# EasyEDA Pro project ProPrj_Microros_esp32_2025-06-17.epro, board PCB_V3.0
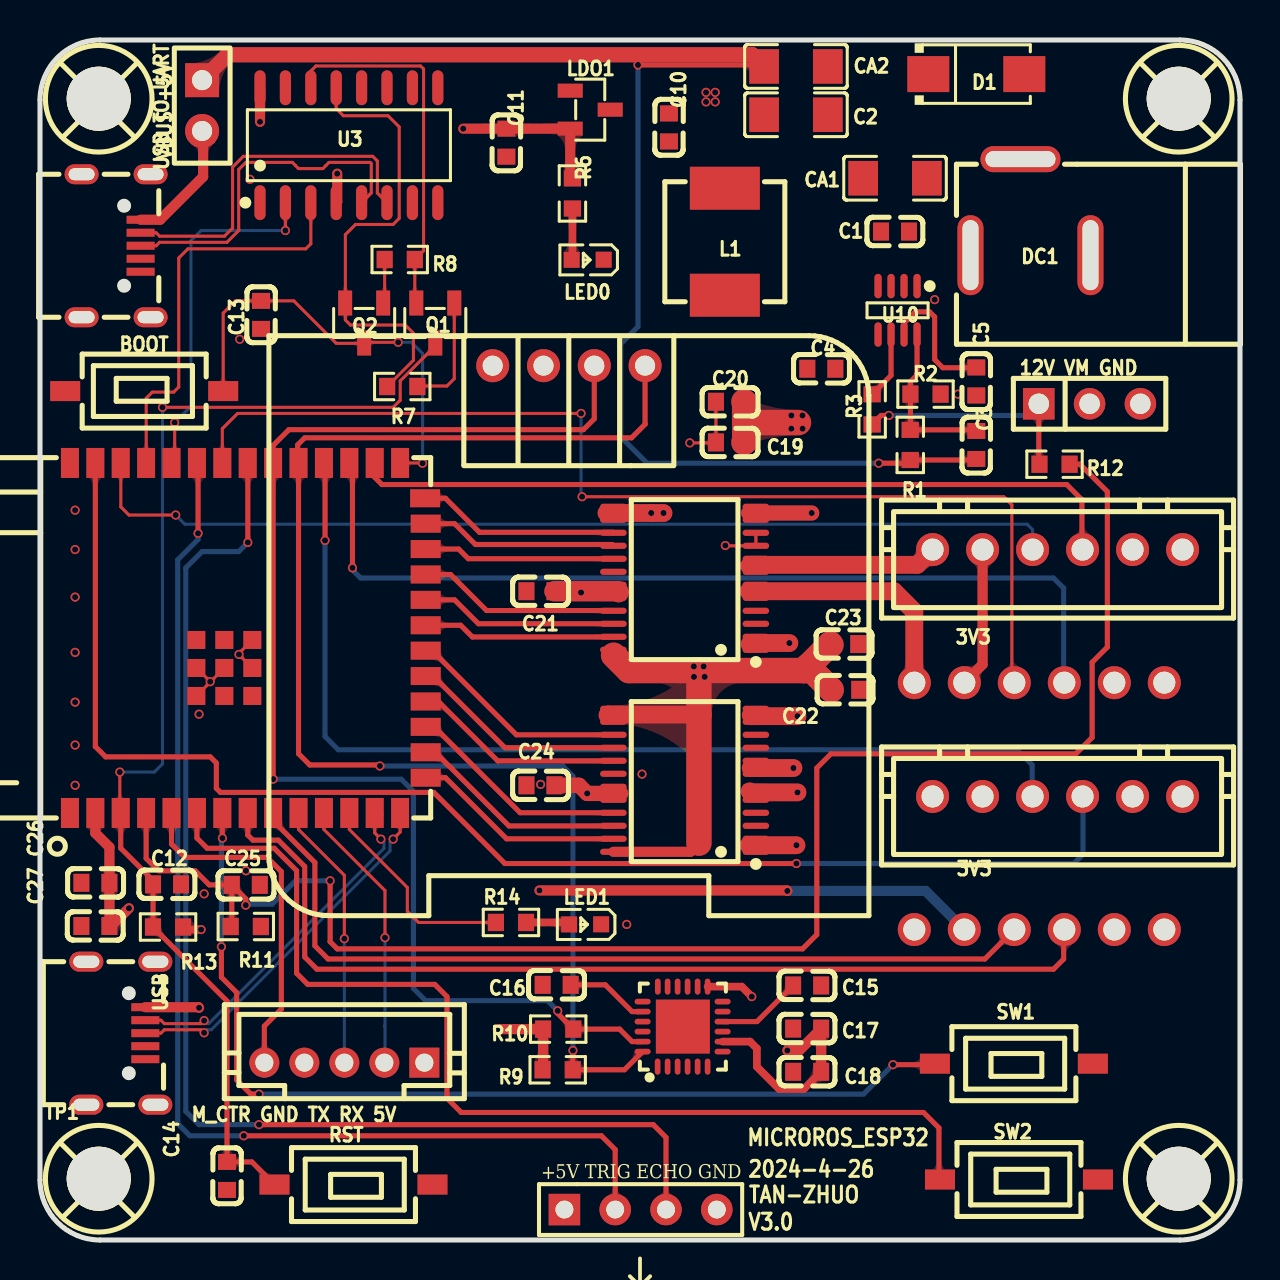
[diagram p4: board, top side]
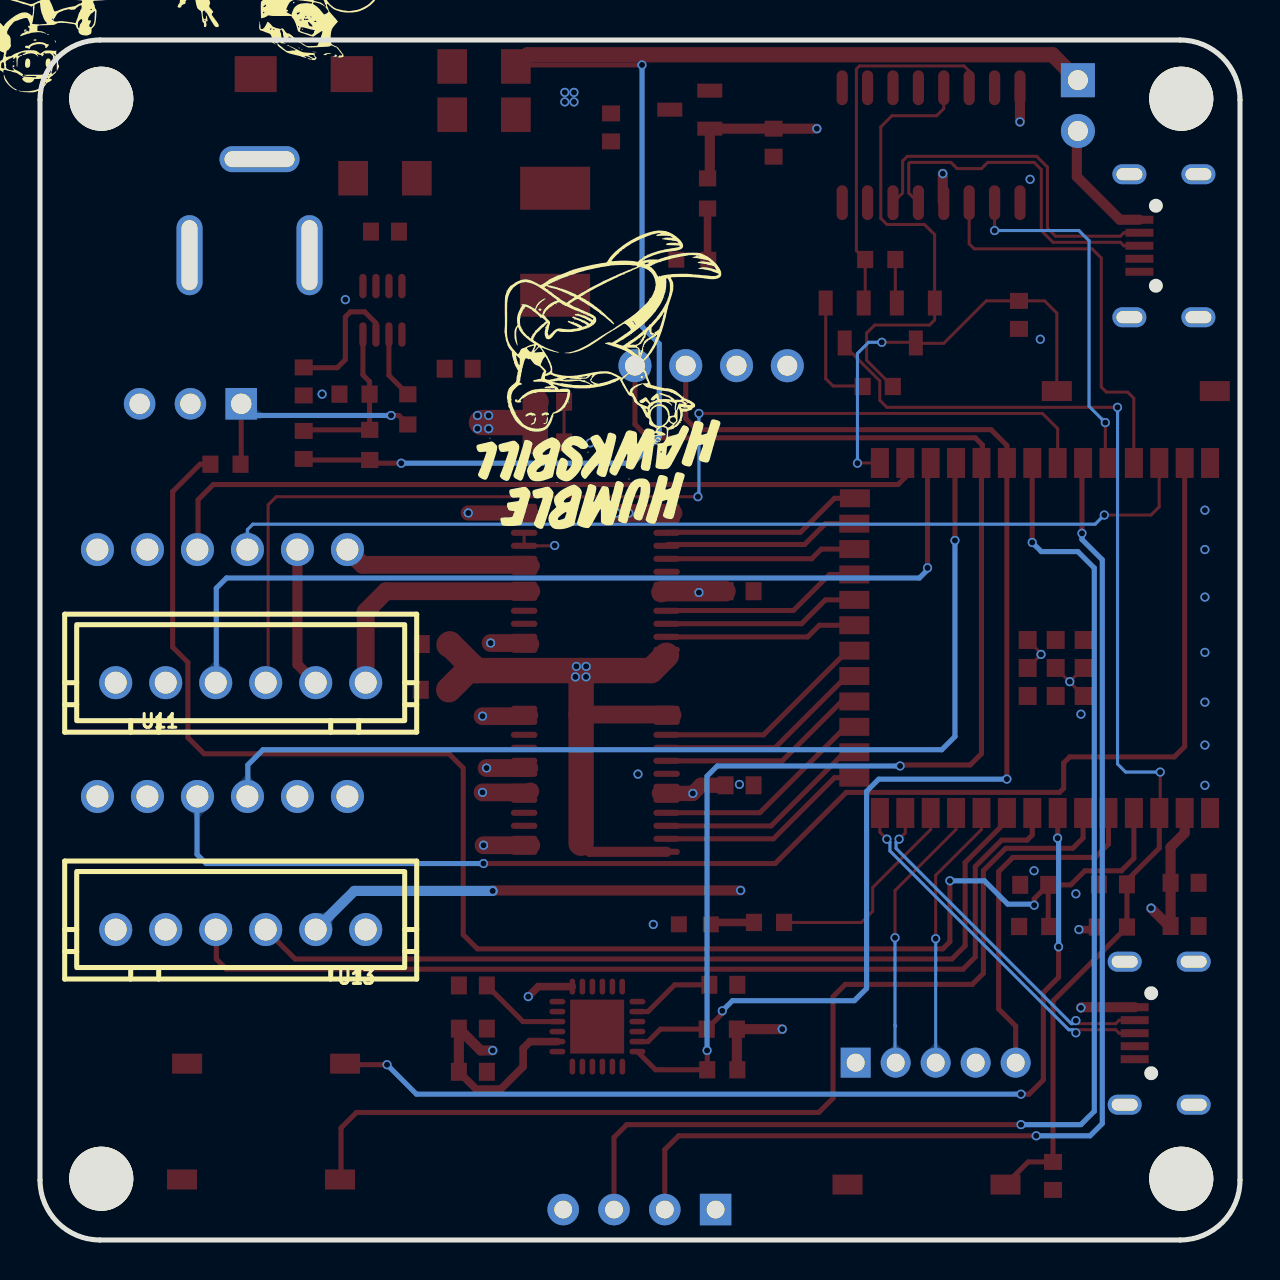
[diagram p5: board, bottom side, seen from below]

Outline 60 x 60 mm; copper layers: Top Layer, GND, POWER, Bottom Layer. Coordinates in mm from the lower left corner of the outline.
Outline path: 0,57 0,3 arc(0.88,0.88) 3,0 57,0 arc(59.12,0.88) 60,3 60,57 arc(59.12,59.12) 57,60 3,60 arc(0.88,59.12) 0,57
Stack: Top Layer 0.035mm 外层铜厚1oz / Dielectric1 0.2104mm 7628 RC49% 8.6mil / GND 0.0152mm 内层铜厚 / Dielectric2 1.065mm 1.1mm H/HOZ 含铜 / POWER 0.0152mm 内层铜厚 / Dielectric3 0.2104mm 7628 RC49% 8.6mil / Bottom Layer 0.035mm 外层铜厚1oz

## Design rules (mm)
net USB_DP: DP1
net USB_DN: DP1
net GPIO_19: DP2
net GPIO_20: DP2
template: 自定义配置
spacing copperThickness1oz (default): track to track 0.102, other pairs 0 to 0.3
spacing copperThickness2oz: track to track 0.203, other pairs 0.152 to 0.3
track width copperThickness1oz (default): min 0.127, default 0.178, max 2.54
track width copperThickness2oz: min 0.203, default 0.254, max 2.54
differential pair differentialPair (default): width min 0.152, default 0.152, max 0.152; gap min 0.152, default 0.152
via viaSize (default): diameter min 0.254, default 0.457, max 10; hole min 0.3, default 0.305, max 6.299

## Placement (name value [footprint] x y rotation side)
3V3  -  [CONN-TH_XH2.54-6P]  50.88 34.52 0 top
3V3#2  -  [CONN-TH_XH2.54-6P]  50.88 22.18 0 top
12V VM GND  -  [HDR-TH_3P-P2.54-V-F]  52.48 41.81 0 top
+5V TRIG ECHO GND  -  [HC-SR04]  30 1.49 0 top
BOOT  -  [Key_SMD_3.6x6.1x2.5]  5.21 42.45 0 top
C1  0.1uf  [C0603]  42.75 50.42 0 top
C2  22uf  [C1206]  37.8 56.26 180 top
C3  33PF  [C0603]  46.81 39.75 90 top
C4  0.1uf  [C0603]  39.07 43.56 180 top
C5  0.1uf  [C0603]  46.81 42.93 90 top
C10  1uf  [C0603]  31.45 55.63 270 top
C11  1uf  [C0603]  23.32 54.87 90 top
C12  1uf  [C0603]  6.35 17.78 0 top
C13  0.1uf  [C0603]  11.05 46.26 270 top
C14  0.1uf  [C0603]  9.35 3.2 270 top
C15  0.1uf  [C0603]  38.36 12.73 0 top
C16  2.2uf  [C0603]  25.83 12.76 0 top
C17  10nf  [C0603]  38.36 10.57 0 top
C18  0.1uf  [C0603]  38.36 8.41 0 top
C19  10uf  [C0603]  34.5 39.88 180 top
C20  0.1uf  [C0603]  34.5 41.91 180 top
C21  0.1uf  [C0603]  25.02 32.44 180 top
C22  10uf  [C0603]  40.26 27.51 0 top
C23  0.1uf  [C0603]  40.21 29.8 0 top
C24  0.1uf  [C0603]  25.02 22.74 180 top
C25  0.1uf  [C0603]  10.29 17.76 180 top
C26  22uF  [C0603]  2.77 17.86 180 top
C27  100nF  [C0603]  2.77 15.7 0 top
CA1  22uf  [C1206]  42.75 53.09 0 top
CA2  22uf  [C1206]  37.8 58.68 0 top
D1  SMAJ12A  [SMA_L4.3-W2.8-LS5.1-RD]  46.81 58.3 0 top
DC1  -  [DC-2.0]  49.65 48.97 0 top
L1  4.7uH  [IND-SMD_L6.5-W6.0_GPSR0630]  34.24 49.91 90 top
LDO1  SC662K-3.3V  [SOT-23-3_L2.9-W1.3-P1.90-LS2.4-BR]  27.51 56.52 180 top
LED0  -  [LED_0603]  27.33 49 180 top
LED1  -  [LED_0603]  27.21 15.78 180 top
M_CTR GND TX RX 5V  BX-PH2.0-5PZZ  [CONN-TH_5P-P2.00_BX-PH2.0-5PZZ]  15.22 8.87 180 top
OLED1  0.96OLED_4P_MODULE_JX  [0.96OLED_4P]  26.44 43.72 0 top
Q1  L8050QLT1G  [SOT-23-3_L2.9-W1.3-P1.90-LS2.4-BR]  19.76 45.85 90 top
Q2  L8050QLT1G  [SOT-23-3_L2.9-W1.3-P1.90-LS2.4-BR]  16.21 45.85 90 top
R1  -  [R0603]  43.51 39.75 90 top
R2  -  [R0603]  44.28 42.29 0 top
R3  -  [R0603]  41.61 41.53 90 top
R6  -  [R0603]  26.62 52.33 270 top
R7  -  [R0603]  18.11 42.67 0 top
R8  -  [R0603]  17.99 49.02 180 top
R9  -  [R0603]  25.88 8.51 180 top
R10  -  [R0603]  25.91 10.54 180 top
R11  -  [R0603]  10.29 15.67 180 top
R12  -  [R0603]  50.73 38.79 180 top
R13  10kΩ  [R0603]  6.4 15.65 0 top
R14  -  [R0603]  23.55 15.88 0 top
RST  -  [Key_SMD_3.6x6.1x2.5]  15.67 2.77 180 top
SW1  -  [Key_SMD_3.6x6.1x2.5]  48.69 8.82 180 top
SW2  -  [Key_SMD_3.6x6.1x2.5]  48.95 3.03 180 top
TP1  -  [M3螺丝]  3 3 0 top
TP2  -  [M3螺丝]  57 3 0 top
TP3  -  [M3螺丝]  57 57 0 top
TP4  -  [M3螺丝]  3 57 0 top
U1  ESP32-S3-WROOM-1-N16R2  [WIRELM-SMD_ESP32-S3-WROOM-1]  10.39 30.1 90 top
U3  CH340C  [SOP-16_L10.0-W3.9-P1.27-LS6.0-BL]  15.45 54.74 0 top
U6  MPU-6050  [QFN-24_L4.0-W4.0-P0.50-BL-EP2.7]  32.13 10.67 0 top
U7  TB6612FNG,C,8,EL  [SSOP-24_L8.3-W5.6-P0.65-LS7.6-BL]  32.23 33.08 90 top
U8  TB6612FNG,C,8,EL  [SSOP-24_L8.3-W5.6-P0.65-LS7.6-BL]  32.23 22.98 90 top
U10  MP2225GJ-Z  [TSOT-23-8_L2.9-W1.6-P0.65-LS2.8-BR]  42.88 46.48 90 top
U11  6PIN-2.54MM  [CONN-TH_XH2.54-6P]  49.96 27.87 0 bottom
U13  6PIN-2.54MM  [CONN-TH_XH2.54-6P]  49.96 15.52 0 bottom
USB  -  [USB_Micro]  4.04 10.34 270 top
USB TO UART  -  [USB_Micro]  3.81 49.71 270 top
VBUS +5V  -  [HDR-TH_2P-P2.54-V-F]  8.1 56.72 270 top

## Footprints (pads in the part's own frame, mm; a bottom-side part is the same pattern mirrored in y, then rotated)
0.96OLED_4P
  round 1.65 hole 1: 1(-3.81,-0.002) 2(-1.27,0.002) 3(1.27,0.002) 4(3.81,0.002)
C0603
  rect 0.8x0.9 smd: 1(-0.7,0) 2(0.7,0)
C1206
  rect 1.485x1.728 smd: 1(-1.593,0) 2(1.593,0)
CONN-TH_5P-P2.00_BX-PH2.0-5PZZ
  rect 1.5x1.5 hole 0.9: 1(-4,0)
  round 1.5 hole 0.9: 2(-2,0) 3(0,0) 4(2,0) 5(4,0)
CONN-TH_XH2.54-6P
  round 1.65 hole 1.1: 1(-6.25,0) 2(-3.75,0) 3(-1.25,0) 4(1.25,0) 5(3.75,0) 6(6.25,0)
DC-2.0
  oval 4x1.3 hole 3.5x0.8: 2(-0.627,5.067)
  oval 1.3x4 hole 0.8x3.5: 3(2.873,0.267) 4(-3.127,0.267)
HC-SR04
  rect 1.575x1.575 hole 0.889: 1(-3.78,0.03)
  round 1.575 hole 0.889: 2(-1.24,0.03) 3(1.3,0.03) 4(3.84,0.03)
HDR-TH_2P-P2.54-V-F
  rect 1.7x1.7 hole 1: 1(-1.27,0)
  round 1.7 hole 1: 2(1.27,0)
HDR-TH_3P-P2.54-V-F
  rect 1.575x1.575 hole 1.02: 1(-2.54,0)
  round 1.575 hole 1.02: 2(0,0) 3(2.54,0)
IND-SMD_L6.5-W6.0_GPSR0630
  rect 2.15x3.5 smd: 1(-2.675,0) 2(2.675,0)
Key_SMD_3.6x6.1x2.5
  rect 1.501x1.001 smd: 1(-3.95,0) 2(3.95,0)
LED_0603
  rect 0.8x0.8 smd: 1(-0.851,-0.01) 2(0.75,-0.005)
M3螺丝
  round 3.2 hole 3.2: 1(-0.064,0.064)
QFN-24_L4.0-W4.0-P0.50-BL-EP2.7
  oval 0.28x0.8 smd: 1(-1.25,-2) 2(-0.75,-2) 3(-0.25,-2) 4(0.25,-2) 5(0.75,-2) 6(1.25,-2) 13(1.25,2) 14(0.75,2) 15(0.25,2) 16(-0.25,2) 17(-0.75,2) 18(-1.242,2)
  oval 0.8x0.28 smd: 7(2,-1.25) 8(2,-0.75) 9(2,-0.25) 10(2,0.25) 11(2,0.75) 12(2,1.25) 19(-2,1.25) 20(-2,0.75) 21(-2,0.25) 22(-2,-0.25) 23(-2,-0.75) 24(-2,-1.25)
  rect 2.7x2.7 smd: 25(0.013,0)
R0603
  rect 0.806x0.864 smd: 1(-0.753,0) 2(0.753,0)
SMA_L4.3-W2.8-LS5.1-RD
  rect 2.1x1.8 smd: 1(-2.4,0) 2(2.4,0)
SOP-16_L10.0-W3.9-P1.27-LS6.0-BL
  oval 0.56x1.745 smd: 1(-4.445,-2.873) 2(-3.175,-2.873) 3(-1.905,-2.873) 4(-0.635,-2.873) 5(0.635,-2.873) 6(1.905,-2.873) 7(3.175,-2.873) 8(4.445,-2.873) 9(4.445,2.873) 10(3.175,2.873) 11(1.905,2.873) 12(0.635,2.873) 13(-0.635,2.873) 14(-1.905,2.873) 15(-3.175,2.873) 16(-4.445,2.873)
SOT-23-3_L2.9-W1.3-P1.90-LS2.4-BR
  rect 1.25x0.7 smd: 1(1,-0.95) 2(1,0.95) 3(-1,0)
SSOP-24_L8.3-W5.6-P0.65-LS7.6-BL
  oval 0.308x1.324 smd: 1(-3.575,-3.562) 2(-2.925,-3.562) 3(-2.275,-3.562) 4(-1.625,-3.562) 5(-0.975,-3.562) 6(-0.325,-3.562) 7(0.325,-3.562) 8(0.975,-3.562) 9(1.625,-3.562) 10(2.275,-3.562) 11(2.925,-3.562) 12(3.575,-3.562) 13(3.575,3.562) 14(2.925,3.562) 15(2.275,3.562) 16(1.625,3.562) 17(0.975,3.562) 18(0.325,3.562) 19(-0.325,3.562) 20(-0.975,3.562) 21(-1.625,3.562) 22(-2.275,3.562) 23(-2.925,3.562) 24(-3.575,3.562)
TSOT-23-8_L2.9-W1.6-P0.65-LS2.8-BR
  oval 1.222x0.364 smd: 1(1.211,-0.975) 2(1.211,-0.325) 3(1.211,0.325) 4(1.211,0.975) 5(-1.211,0.975) 6(-1.211,0.325) 7(-1.211,-0.325) 8(-1.211,-0.975)
USB_Micro
  rect 0.4x1.4 smd: 1(-1.3,1.225) 2(-0.65,1.225) 3(0,1.225) 4(0.65,1.225) 5(1.3,1.225)
  oval 1x1.7 hole 0.6x1.3: 6(-3.575,1.725) 6(-3.575,-1.725) 6(3.575,1.725) 6(3.575,-1.725)
WIRELM-SMD_ESP32-S3-WROOM-1
  rect 1.5x0.9 smd: 1(-8.75,8.895) 2(-8.75,7.625) 3(-8.75,6.355) 4(-8.75,5.085) 5(-8.75,3.815) 6(-8.75,2.545) 7(-8.75,1.275) 8(-8.75,0.005) 9(-8.75,-1.265) 10(-8.75,-2.535) 11(-8.75,-3.805) 12(-8.75,-5.075) 13(-8.75,-6.345) 14(-8.75,-7.615) 27(8.75,-7.615) 28(8.75,-6.345) 29(8.75,-5.075) 30(8.75,-3.805) 31(8.75,-2.535) 32(8.75,-1.265) 33(8.75,0.005) 34(8.75,1.275) 35(8.75,2.545) 36(8.75,3.815) 37(8.75,5.085) 38(8.75,6.355) 39(8.75,7.625) 40(8.75,8.895)
  rect 0.9x1.5 smd: 15(-6.985,-8.895) 16(-5.715,-8.895) 17(-4.445,-8.895) 18(-3.175,-8.895) 19(-1.905,-8.895) 20(-0.635,-8.895) 21(0.635,-8.895) 22(1.905,-8.895) 23(3.175,-8.895) 24(4.445,-8.895) 25(5.715,-8.895) 26(6.985,-8.865)
  rect 0.9x0.9 smd: 41(-2.9,2.575) 41(-2.9,1.175) 41(-2.9,-0.225) 41(-1.5,2.575) 41(-1.5,1.175) 41(-1.5,-0.225) 41(-0.1,2.575) 41(-0.1,1.175) 41(-0.1,-0.225)

## Nets
+5V: +5V TRIG ECHO GND.1 C2.2 C3.1 C10.1 C21.1 C24.1 CA2.1 L1.2 LDO1.3 M_CTR GND TX RX 5V.1 OLED1.2 R1.1 U7.19 U7.20 U8.19 U8.20 USB.1 VBUS +5V.1
+12V: 12V VM GND.1 C1.2 CA1.2 D1.1 DC1.4 R3.1 R12.2 U10.2
GND: 3V3.5 3V3#2.5 12V VM GND.3 +5V TRIG ECHO GND.4 BOOT.1 C1.1 C2.1 C5.1 C10.2 C11.1 C12.2 C13.2 C14.2 C15.2 C16.1 C17.1 C18.1 C19.2 C20.2 C21.2 C22.2 C23.2 C24.2 C25.1 C26.2 C27.1 CA1.1 CA2.2 D1.2 DC1.2 DC1.3 LDO1.1 LED0.1 LED1.1 M_CTR GND TX RX 5V.4 OLED1.1 R2.2 R11.1 RST.1 SW1.1 SW2.1 U1.1 U1.40 U1.41 U3.1 U6.1 U6.9 U6.11 U6.18 U6.25 U7.3 U7.4 U7.9 U7.10 U7.18 U8.3 U8.4 U8.9 U8.10 U8.18 U10.1 U10.4 U11.5 U13.5 USB.5 USB.6 USB TO UART.5 USB TO UART.6
VBUS1: USB TO UART.1 VBUS +5V.2
VCC_3V3: 3V3.2 3V3#2.2 C11.2 C17.2 C18.2 C26.1 C27.2 LDO1.2 R6.1 R9.2 R10.2 R13.2 U1.2 U3.4 U3.16 U6.8 U6.13 U11.2 U13.2
ADC: C25.2 R11.2 R12.1 U1.4
DTR: Q2.2 R7.1 U3.13
ECHO: +5V TRIG ECHO GND.3 U1.33
ENCODE1_A: U1.29 U11.4
ENCODE1_B: U1.34 U11.3
ENCODE2_A: 3V3.4 U1.28
ENCODE2_B: 3V3.3 U1.38
ENCODE3_A: U1.8 U13.4
ENCODE3_B: U1.9 U13.3
ENCODE4_A: 3V3#2.4 U1.39
ENCODE4_B: 3V3#2.3 U1.30
ESP_RST: C12.1 C14.1 Q1.3 R13.1 RST.2 U1.3
ESP_RX: U1.36 U3.2
ESP_TX: U1.37 U3.3
GPIO_0: BOOT.2 C13.1 Q2.3 U1.27
GPIO_3: U1.15 U8.23
GPIO_5: M_CTR GND TX RX 5V.5 U1.5
GPIO_6: SW2.2 U1.6
GPIO_7: SW1.2 U1.7
GPIO_8: R14.1 U1.12
GPIO_9: U1.17 U8.21
GPIO_10: U1.18 U8.17
GPIO_11: U1.19 U8.16
GPIO_12: U1.20 U8.15
GPIO_13: U1.21 U7.23
GPIO_14: U1.22 U7.22
GPIO_19: U1.13 USB.2
GPIO_20: U1.14 USB.3
GPIO_21: U1.23 U7.21
GPIO_38: OLED1.4 R9.1 U1.31 U6.24
GPIO_39: OLED1.3 R10.1 U1.32 U6.23
GPIO_42: +5V TRIG ECHO GND.2 U1.35
GPIO_45: U1.26 U7.15
GPIO_46: U1.16 U8.22
GPIO_47: U1.24 U7.17
GPIO_48: U1.25 U7.16
M1_AO1: U7.1 U7.2 U11.6
M1_AO2: U7.5 U7.6 U11.1
M1_BO1: 3V3.6 U7.11 U7.12
M1_BO2: 3V3.1 U7.7 U7.8
M2_AO1: U8.1 U8.2 U13.6
M2_AO2: U8.5 U8.6 U13.1
M2_BO1: 3V3#2.6 U8.11 U8.12
M2_BO2: 3V3#2.1 U8.7 U8.8
RTS: Q1.2 R8.1 U3.14
U1_RX: M_CTR GND TX RX 5V.2 U1.11
U1_TX: M_CTR GND TX RX 5V.3 U1.10
USB_DN: U3.6 USB TO UART.2
USB_DP: U3.5 USB TO UART.3
VMOTOR: 12V VM GND.2 C19.1 C20.1 C22.1 C23.1 U7.13 U7.14 U7.24 U8.13 U8.14 U8.24
$1N8417: LED0.2 R6.2
$1N8423: Q1.1 R7.2
$1N8428: Q2.1 R8.2
$1N8498: C15.1 U6.10
$1N8500: C16.2 U6.20
$1N8840: C5.2 U10.7
$1N8848: R3.2 U10.6
$1N8850: C4.2 L1.1 U10.3
$1N8851: C4.1 U10.5
$1N8854: C3.2 R1.2 R2.1 U10.8
$1N21655: LED1.2 R14.2

Pads without a net: TP1 1; TP2 1; TP3 1; TP4 1; U3 7 8 9 10 11 12 15; U6 2 3 4 5 6 7 12 14 15 16 17 19 21 22; USB 4; USB TO UART 4

## Via types
v1: diameter 0.457, hole 0.305, Top Layer to Bottom Layer, 89 vias

## Routing (per net, layer and track width the routed paths; a pad name or vN(x,y) marks a point on that pad's centre or on a via; arc(x,y) is an arc through that point)
+5V: length 169.6
  Top Layer w0.254: C3.1 46.76,39 R1.1 43.35,38.84 v1(41.94,38.84) ; 36.13,58.75 v1(29.9,58.75)
  Top Layer w0.508: USB.1 7.92,11.64 v1(7.95,11.61)
  Top Layer w0.762: 25.79,22.74 26.95,22.74 v1(27.36,22.33) 28.88,22.33 28.93,22.38 28.98,22.38 29.03,22.33 ; 36.21,58.68 36.13,58.75 35.62,59.26 9.38,59.26 VBUS +5V.1
  Top Layer w1.016: C21.1 28.88,32.44 28.93,32.39
  POWER w0.508: v1(7.95,11.61) 8.21,11.86 17.81,11.86 18.98,10.7 19.22,10.7 25.43,4.48 28.41,4.48
  POWER w1.016: +5V TRIG ECHO GND.1 26.22,2.29 28.41,4.48 28.41,9.46 27.09,10.78 27.36,11.05 v1(27.36,22.33) 27.05,22.63 v1(27.05,32.37) 27.05,33 26.09,33.96 26.09,43.77 26.04,43.82 26.04,54.99 27.95,56.91 v1(33.76,56.91)
  Bottom Layer w0.254: v1(41.94,38.84) 30.36,38.84 29.03,40.16 29.03,44.8 29.9,45.67 v1(29.9,58.75)
  vias: v1(33.3,57.38) v1(33.3,56.9) v1(33.76,57.38)
+12V: length 11.8
  Top Layer w0.254: 12V VM GND.1 49.94,38.82 R12.2 ; v1(42.45,41.23) 42.06,41.23 R3.1
  Bottom Layer w0.254: v1(42.45,41.23) 49.35,41.23 12V VM GND.1
GND: length 16.3
  Top Layer w0.152: v1(34.27,34.72) 34.28,34.71 U7.9 U7.10 ; U1.41 8.53,27.92 v1(8.51,27.92) ; v1(32.49,39.86) 33.77,39.86 C19.2 C20.2 ; U1.41 7.83,28.6 v1(8.51,27.92) ; v1(8.51,27.92) 8.51,27.9 U1.41 ; U1.41 10.09,29.13 10.09,29.14 v1(9.95,29.28) 9.95,29.33 U1.41
  GND w0.152: v1(34.27,34.72) 34.27,37.62 32.49,39.4 v1(32.49,39.86)
  vias: v1(1.75,36.49) v1(1.75,34.52) v1(1.75,32.15) v1(1.75,29.38) v1(1.75,26.89) v1(1.75,24.75) v1(1.75,22.74) v1(7.95,26.29) v1(8.21,17.31) v1(9.99,45.04) v1(10.3,18.46) v1(10.5,53.03) v1(25.03,22.78) v1(29.34,15.78) v1(30.1,23.29) v1(44.73,47.02) v1(45.9,42.29)
VBUS1: length 6.3
  Top Layer w0.508: VBUS +5V.2 8.16,55.4 8.16,53.17 6,51.01 USB TO UART.1
VCC_3V3: length 172
  Top Layer w0.381: U6.8 35.5,9.92 35.84,9.58 35.84,8.66 36.96,7.55 38.19,7.55 C18.2 ; v1(35.59,12.17) 35.09,12.67 U6.13 ; R13.2 7.28,15.52 v1(8.05,15.52)
  Top Layer w0.508: v1(4.45,16.59) 3.56,15.7 C27.2 C26.1 3.47,19.64 2.77,20.35 U1.2 ; U3.4 14.86,51.92 v1(14.86,53.32) ; v1(37.37,9.48) 37.96,9.48 C17.2 C18.2 ; LDO1.2 26.51,53.19 R6.1 ; 26.51,55.57 C11.2 v1(21.16,55.57) ; R9.2 25.16,8.54 R10.2 v1(22.89,10.54) ; v1(37.37,17.45) 37.34,17.48 v1(24.97,17.48) ; U11.2 47.13,28.78 3V3.2 ; v1(11,55.91) 11,57.51
  GND w0.508: 3V3#2.2 47.13,26.95 U11.2
  POWER w0.381: v1(37.37,9.48) 36.76,9.48 36.35,9.88 36.35,11.41 v1(35.59,12.17) ; 8.54,16.26 8.05,15.77 v1(8.05,15.52)
  POWER w0.508: v1(37.37,17.45) v1(37.37,9.48) ; 14.86,55.55 v1(14.86,53.32) ; 14.86,55.55 11.36,55.55 v1(11,55.91) ; 14.86,55.55 14.88,55.57 v1(21.16,55.57) 21.16,17.48 ; 21.16,17.48 21.16,15.81 ; 21.16,17.48 v1(24.97,17.48) ; 21.16,15.81 8.99,15.81 8.54,16.26 8.21,16.59 v1(4.45,16.59) ; 21.16,15.81 21.16,10.65 21.26,10.54 v1(22.89,10.54) ; U13.2 47.13,16.44 3V3#2.2
  Bottom Layer w0.508: v1(37.37,17.45) 44.28,17.45 U13.2
ADC: length 80.9
  Top Layer w0.254: U1.4 5.31,19.08 5.93,18.46 7.76,18.46 8.46,17.76 C25.2 ; R11.2 9.59,15.73 C25.2 ; v1(10.29,16.74) 10.29,17.06 C25.2 ; v1(14.51,17.96) 14.51,14.91 14.86,14.56 38.13,14.56 38.84,15.27 38.84,23.6 39.55,24.31 51.79,24.31 52.61,25.12 52.61,28.88 53.37,29.64 53.37,37.42 52,38.79 R12.1
  Bottom Layer w0.254: v1(14.51,17.96) 12.78,17.96 11.61,16.79 10.34,16.79 v1(10.29,16.74)
DTR: length 23.3
  Top Layer w0.152: R7.1 18.67,43.99 18.67,45.34 18.26,45.75 15.52,45.75 15.27,46 15.27,46.84 Q2.2 15.27,46.86 15.27,50.27 15.78,50.78 17.66,50.78 17.96,51.08 17.96,55.65 17.4,56.21 15.17,56.21 14.81,56.57 U3.13
ECHO: length 62.9
  Top Layer w0.254: v1(10.39,34.88) 10.39,38.85 U1.33 ; +5V TRIG ECHO GND.3 31.3,5.13 30.66,5.77 v1(10.95,5.77)
  Bottom Layer w0.254: v1(10.95,5.77) 7.95,5.77 7.29,6.43 7.29,33.6 8.1,34.42 9.93,34.42 v1(10.39,34.88)
ENCODE1_A: length 46.1
  Top Layer w0.254: U1.29 15.62,38.69 v1(15.62,33.61)
  Bottom Layer w0.254: v1(15.62,33.61) 15.62,33.5 16.03,33.1 50.68,33.1 51.18,32.59 51.18,27.9 U11.4
ENCODE1_B: length 54.8
  Top Layer w0.152: v1(27.1,37.16) 48.19,37.16 48.59,36.76 48.59,27.99 U11.3 ; U1.34 9.12,40.57 9.88,41.33 v1(27.05,41.33)
  Bottom Layer w0.152: v1(27.05,41.33) 27.05,37.21 v1(27.1,37.16)
ENCODE2_A: length 39
  Top Layer w0.254: 3V3.4 52.1,34.55 52.1,37.01 51.34,37.77 17.1,37.77 16.74,38.13 U1.28
ENCODE2_B: length 49.3
  Top Layer w0.152: U1.38 4.04,38.85 4.04,36.66 4.45,36.25 v1(6.78,36.25)
  Bottom Layer w0.152: v1(6.78,36.25) 7.24,35.79 49.35,35.79 49.63,35.52 3V3.3
ENCODE3_A: length 49
  Top Layer w0.254: U1.8 10.39,20.25 10.65,19.99 11.91,19.99 13.24,18.67 13.24,14.15 13.85,13.54 50.68,13.54 51.18,14.05 51.18,15.49 U13.4
ENCODE3_B: length 43.4
  Top Layer w0.254: U1.9 11.66,20.96 13.74,18.88 13.74,14.71 14.4,14.05 47.24,14.05 U13.3
ENCODE4_A: length 69.8
  Top Layer w0.254: v1(37.82,18.82) 23.24,18.82 19.69,22.38 9.02,22.38 8.82,22.58 8.82,23.85 8.51,24.16 3.28,24.16 2.77,24.67 U1.39
  Bottom Layer w0.254: v1(37.82,18.82) 51.69,18.82 52.15,19.28 52.15,22.16 3V3#2.4
ENCODE4_B: length 51.2
  Top Layer w0.254: v1(14.25,34.98) 14.25,38.8 U1.30
  Bottom Layer w0.254: v1(14.25,34.98) 14.25,25.17 14.91,24.51 48.85,24.51 49.61,23.75 49.61,22.2 3V3#2.3
ESP_RST: length 60.3
  Top Layer w0.152: v1(6.12,41.63) 17.66,41.63 18.01,41.99 18.01,42.95 19.76,44.71 Q1.3 ; v1(3.99,23.4) 3.99,21.4 U1.3
  Top Layer w0.254: RST.2 10.59,3.9 C14.1 9.35,11.95 R13.1 5.65,15.65 C12.1 5.65,17.97 4.04,19.59 U1.3
  Bottom Layer w0.152: v1(6.12,41.63) 6.12,23.8 5.72,23.4 v1(3.99,23.4)
ESP_RX: length 17.8
  Top Layer w0.152: U1.36 6.73,39.01 v1(6.73,40.87) ; v1(12.27,50.47) U3.2
  Bottom Layer w0.152: v1(12.27,50.47) 8.05,50.47 7.55,49.96 7.55,41.68 v1(6.73,40.87)
ESP_TX: length 20.5
  Top Layer w0.152: U1.37 5.31,38.86 5.31,42.09 5.62,42.39 6.68,42.39 6.94,42.65 6.94,49.1 7.39,49.56 13.29,49.56 13.54,49.81 U3.3
GPIO_0: length 21.9
  Top Layer w0.152: v1(17.91,44.88) 16.24,44.88 Q2.3 16.19,44.83 14.81,44.83 12.69,46.96 C13.1 9.77,46.96 9.16,46.34 9.16,42.45 ; U1.27 19.12,38.85 v1(19.13,38.84)
  Bottom Layer w0.152: v1(19.13,38.84) 19.13,44.33 18.57,44.88 v1(17.91,44.88)
GPIO_3: length 10.6
  Top Layer w0.254: U8.23 23.33,20.06 20.27,23.12 U1.15
GPIO_5: length 17.5
  Top Layer w0.254: U1.5 6.58,19.79 7.24,19.13 11.36,19.13 12.07,18.42 12.07,11.55 11.22,10.7 M_CTR GND TX RX 5V.5
GPIO_6: length 52.9
  Top Layer w0.254: U1.6 7.85,20.1 8.36,19.59 11.71,19.59 12.83,18.47 12.83,13.34 13.39,12.78 19.74,12.78 20.35,12.17 20.35,7.09 21.06,6.38 44.17,6.38 44.95,5.6 44.95,3.08 45,3.03
GPIO_7: length 49.5
  Top Layer w0.254: v1(10.95,7.29) 10.54,7.29 9.83,8 9.83,12.37 9.07,13.13 v1(9.07,14.66) ; v1(9.12,20.09) 9.12,20.1 U1.7 ; SW1.2 44.69,8.77 42.7,8.77
  Bottom Layer w0.254: v1(10.95,7.29) 41.18,7.29 v1(42.65,8.77) ; v1(9.07,14.66) 9.07,20.04 v1(9.12,20.09)
GPIO_8: length 10.8
  Top Layer w0.152: R14.1 18.93,15.88 18.37,16.44 18.37,17.62 15.47,20.53 U1.12
GPIO_9: length 11.2
  Top Layer w0.254: U1.17 19.71,25.66 24.01,21.36 28.66,21.36 U8.21
GPIO_10: length 10.6
  Top Layer w0.254: 28.67,23.96 28.66,23.95 22.89,23.95 19.92,26.93 U1.18
GPIO_11: length 10.9
  Top Layer w0.254: U1.19 19.66,28.2 23.24,24.61 28.66,24.61 U8.16
GPIO_12: length 11.1
  Top Layer w0.254: U1.20 19.61,29.47 23.82,25.26 U8.15
GPIO_13: length 9.6
  Top Layer w0.254: U1.21 21.03,30.74 21.62,30.15 28.66,30.15 U7.23
GPIO_14: length 9.9
  Top Layer w0.254: U1.22 20.73,32.01 21.92,30.81 28.66,30.81 U7.22
GPIO_19: length 18.1
  Top Layer w0.152: USB.2 6.04,10.99 6.22,10.82 8.05,10.82 v1(8.21,10.97) ; 17.11,21.26 U1.13 16.74,20.35 v1(17.05,20.04)
  Bottom Layer w0.152: v1(8.21,10.97) 8.36,10.82 8.44,10.82 17.2,19.58 17.2,19.89 v1(17.05,20.04)
GPIO_20: length 18.2
  Top Layer w0.152: USB.3 6.04,10.34 6.22,10.51 8.05,10.51 v1(8.21,10.36) ; U1.14 18.01,20.39 v1(17.66,20.04)
  Bottom Layer w0.152: v1(8.21,10.36) 8.36,10.51 8.56,10.51 17.5,19.45 17.5,19.89 v1(17.66,20.04)
GPIO_21: length 10.1
  Top Layer w0.254: U7.21 28.65,31.47 22.33,31.47 20.53,33.28 U1.23
GPIO_38: length 69
  Top Layer w0.254: 30.25,43.77 30.25,40.79 29.58,40.11 13.24,40.11 12.88,39.75 12.88,38.9 U1.31 12.93,24.32 13.49,23.75 16.94,23.75 v1(17,23.7) ; U6.24 29.22,8.51 R9.1 26.64,9.47 v1(26.65,9.48)
  Bottom Layer w0.254: v1(17,23.7) 26.14,23.7 26.65,23.19 v1(26.65,9.48)
GPIO_39: length 65.9
  Top Layer w0.254: v1(25.88,11.46) 25.88,11.32 R10.1 28.98,10.54 29.6,9.92 U6.23 ; v1(11.66,23.05) U1.32 11.66,39.73 12.44,40.52 27.17,40.52 27.71,41.06 27.71,43.41 28.07,43.77
  Bottom Layer w0.254: v1(11.66,23.05) 11.66,23.04 18.06,23.04 18.67,22.43 18.67,12.58 19.28,11.97 25.38,11.97 v1(25.88,11.46)
GPIO_42: length 58.9
  Top Layer w0.254: U1.35 7.9,38.8 v1(7.9,35.33) ; v1(10.19,5.21) 28.07,5.21 28.76,4.52 +5V TRIG ECHO GND.2
  Bottom Layer w0.254: v1(7.9,35.33) 7.9,35.03 6.89,34.01 6.89,5.82 7.5,5.21 v1(10.19,5.21)
GPIO_45: length 10.1
  Top Layer w0.254: U7.15 28.64,35.39 21.97,35.39 20.27,37.09 U1.26
GPIO_46: length 10.9
  Top Layer w0.254: U1.16 19.76,24.39 23.45,20.7 28.66,20.7 U8.22
GPIO_47: length 9.6
  Top Layer w0.254: U1.24 20.93,34.55 21.41,34.06 28.66,34.06 U7.17
GPIO_48: length 9.8
  Top Layer w0.254: U1.25 20.73,35.82 21.77,34.78 28.6,34.78 U7.16
M1_AO1: length 22.4
  Top Layer w0.889: v1(37.47,29.85) 35.54,29.85 35.49,29.8
  POWER w0.889: U11.6 56.21,29.34 55.71,29.85 v1(37.47,29.85)
M1_AO2: length 12.3
  Top Layer w0.889: 35.44,32.44 42.7,32.44 43.71,31.42 U11.1
M1_BO1: length 22.5
  Top Layer w0.762: 35.44,36.35 v1(38.59,36.35)
  POWER w0.762: 3V3.6 55.3,36.35 v1(38.59,36.35)
M1_BO2: length 9.6
  Top Layer w0.762: 35.54,33.76 35.49,33.81 35.38,33.71
  Top Layer w0.889: 3V3.1 43.87,33.76 35.54,33.76
M2_AO1: length 26.3
  Top Layer w0.889: v1(37.82,19.74) 35.44,19.74
  POWER w0.889: v1(37.82,19.74) 39.5,19.74 40.36,18.88 40.36,14.96 41.63,13.69 54.39,13.69 U13.6
M2_AO2: length 14.2
  Top Layer w0.889: v1(37.87,22.38) 35.54,22.38 35.49,22.43
  POWER w0.889: U13.1 43.71,20.81 42.14,22.38 v1(37.87,22.38)
M2_BO1: length 25.1
  Top Layer w0.889: 35.54,26.24 35.59,26.19 v1(37.87,26.19)
  POWER w0.889: 3V3#2.6 57.13,25.38 56.31,26.19 v1(37.87,26.19)
M2_BO2: length 9.7
  Top Layer w0.889: v1(37.67,23.6) 35.54,23.6
  POWER w0.889: 3V3#2.1 43.21,23.6 v1(37.67,23.6)
RTS: length 18.6
  Top Layer w0.152: U3.14 13.54,58.45 13.79,58.7 19.03,58.7 19.18,58.55 19.18,49.47 R8.1 18.74,46.92 Q1.2
U1_RX: length 13.8
  Top Layer w0.152: U1.11 14.2,20.53 17.25,17.47 v1(17.25,15.12)
  Bottom Layer w0.152: 17.25,10.73 17.22,10.7 ; 17.25,10.73 v1(17.25,15.12) ; 17.25,10.73 17.25,8.9 M_CTR GND TX RX 5V.2
U1_TX: length 13.4
  Top Layer w0.152: v1(15.22,15.06) 15.22,18.23 12.93,20.53 U1.10
  Bottom Layer w0.152: M_CTR GND TX RX 5V.3 v1(15.22,15.06)
USB_DN: length 17.7
  Top Layer w0.152: U3.6 16.87,52.35 16.87,53.95 16.64,54.18 10.17,54.18 9.63,53.65 9.63,50.6 9.22,50.19 5.98,50.19 5.81,50.36 USB TO UART.2
USB_DP: length 17.5
  Top Layer w0.152: U3.5 16.56,52.35 16.56,53.83 16.51,53.88 14.45,53.88 14.3,53.73 14.3,53.72 14.14,53.57 12.93,53.57 12.77,53.72 12.77,53.73 12.62,53.88 10.29,53.88 9.93,53.52 9.93,50.47 9.35,49.89 5.98,49.89 5.81,49.71 USB TO UART.3
VMOTOR: length 75.7
  Top Layer w0.508: U8.24 32.52,19.41 32.95,19.84
  Top Layer w0.889: 32.95,26.27 28.41,26.27 28.37,26.24 ; v1(31.18,36.35) v1(30.56,36.35) 28.32,36.35
  Top Layer w1.27: 35.23,40.87 35.23,41.88 C20.1 ; 35.23,40.87 37.93,40.87 ; 35.23,40.87 35.23,39.92 C19.1 ; 38.6,28.47 38.19,28.47 ; 38.6,28.47 38.4,28.67 38.4,28.68 ; 38.6,28.47 C22.1 ; 38.19,28.47 38.4,28.68 ; 38.19,28.47 32.95,28.47 ; 38.4,28.68 C23.1 39.55,29.76 ; 32.95,28.47 29.44,28.47 28.68,29.24 ; 32.95,28.47 32.95,19.84
  POWER w0.889: 32.95,36.45 32.84,36.35 v1(31.18,36.35)
  POWER w1.27: 12V VM GND.2 52.48,39.19 51.01,37.72 37.82,37.72 ; 37.82,37.72 34.22,37.72 32.95,36.45 32.95,28.12 ; 37.82,37.72 37.82,40.92
  vias: v1(32.69,28.68) v1(32.7,28.16) v1(33.18,28.68) v1(33.23,28.16) v1(37.57,41.23) v1(37.57,40.57) v1(38.12,41.23) v1(38.13,40.57)
$1N8417: length 2.6
  Top Layer w0.381: LED0.2 26.62,49.05 R6.2
$1N8423: length 5.8
  Top Layer w0.152: R7.2 18.89,42.7 20.35,42.7 20.71,43.07 Q1.1
$1N8428: length 2.2
  Top Layer w0.152: Q2.1 17.23,46.92 R8.2
$1N8498: length 4.3
  Top Layer w0.254: U6.10 35.85,10.92 C15.1
$1N8500: length 4.2
  Top Layer w0.254: U6.20 29.6,11.42 28.26,12.76 C16.2
$1N8840: length 6.8
  Top Layer w0.254: C5.2 46.8,43.61 45.14,43.61 44.73,44.02 44.73,46.15 44.48,46.41 43.77,46.41 43.2,45.84 43.2,45.27
$1N8848: length 3.4
  Top Layer w0.254: U10.6 42.55,43.23 R3.2
$1N8854: length 8.2
  Top Layer w0.254: C3.2 46.76,40.51 R1.2 43.52,40.52 R2.1 43.52,42.92 43.85,43.25 U10.8
$1N21655: length 2.2
  Top Layer w0.381: R14.2 26.36,15.88 LED1.2

## Copper pours and planes (outline as drawn; the poured copper is in the pictures)
+5V on Top Layer: 27.49,55.65 32.34,55.65 32.39,55.6 32.39,49.91 37.42,49.91 37.52,49.81 37.52,59.72 37.47,59.77 27.51,59.77 27.46,59.82 27.46,55.65 27.41,55.6 27.45,55.6
+12V on Top Layer: 42.71,48.48 43,48.19 43,47.07 43.39,47.07 43.39,48.32 43.56,48.49 45.29,48.49 45.29,44.69 48.33,44.69 48.39,44.63 48.39,40.31 48.34,40.26 51.4,40.26 51.4,44.74 51.44,44.78 51.44,51.74 45.99,51.74 45.99,59.56 46.05,59.62 42.71,59.62
GND on Top Layer: -10.59,70.08 69.42,70.08 69.42,-8.3 -10.59,-8.3
GND on Top Layer: 37.87,59.52 37.82,59.57 37.82,50.17 41.64,47.07 42.19,47.07 42.19,48.29 42.6,48.69 42.6,59.52
GND on Top Layer: 46.31,59.7 46.31,52.04 51.9,52.04 51.9,44.73 53.72,44.73 53.77,44.68 53.77,39.6 53.82,39.55 59.67,39.55 59.77,39.65 59.77,53.67 59.67,53.77 54.03,53.77 53.93,53.88 53.93,59.67 53.98,59.72 46.28,59.72 46.3,59.7
GND on Bottom Layer: -10.59,70.08 68.71,70.08 68.71,-8.1 -10.59,-8.1
GND on GND: -10.84,69.88 68.5,69.88 68.5,-8.1 -10.84,-8.1
GND on POWER: -10.84,70.08 68.96,70.08 68.96,-8.3 -10.84,-8.3
$1N8850 on Top Layer: 32.26,42.9 39.04,42.9 39.04,46.26 42.28,46.26 42.88,46.86 42.88,48.26 42.75,48.39 42.29,48.39 42.24,48.34 42.24,47.07 42.14,46.97 41.29,46.97 38.79,48.9 32.26,48.9
$1N8851 on Top Layer: 39.36,46.02 39.36,42.85 41.38,42.85 42.14,43.61 42.14,45.95 42.09,46 39.4,46 39.35,46.05 39.35,46.02

Small or netless copper shapes (teardrops, artwork), in the pictures only: 194 on Top Layer, 43 on Bottom Layer, 4 on GND, 16 on POWER

## Text on the board
Top Silkscreen Layer: MICROROS_ESP32 | 2024-4-26 | V3.0 | TAN-ZHUO
